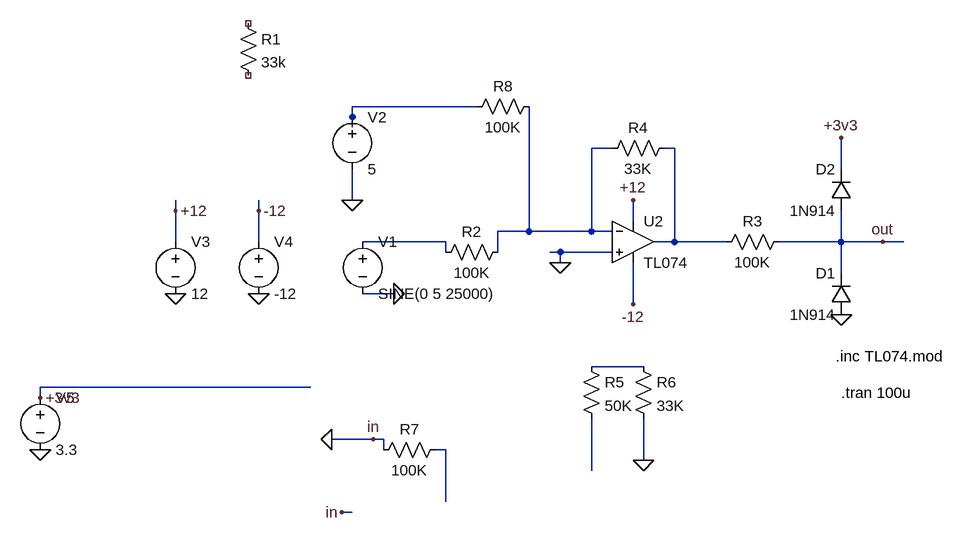
[diagram p0: schematic CVin.asc]
CVin.asc, the LTspice schematic file:
Version 4
SHEET 1 916 752
WIRE 96 64 -96 64
WIRE -96 80 -96 64
WIRE -96 96 -96 80
WIRE 304 128 272 128
WIRE 400 128 384 128
WIRE 656 160 656 112
WIRE -96 208 -96 160
WIRE -368 224 -368 208
WIRE -240 224 -240 208
WIRE 336 240 336 208
WIRE 176 256 176 64
WIRE 176 256 128 256
WIRE 272 256 272 128
WIRE 272 256 176 256
WIRE 304 256 272 256
WIRE -368 272 -368 224
WIRE -240 272 -240 224
WIRE 48 272 -80 272
WIRE 400 272 400 128
WIRE 400 272 368 272
WIRE 480 272 400 272
WIRE 656 272 656 224
WIRE 656 272 560 272
WIRE 720 272 656 272
WIRE 752 272 720 272
WIRE 48 288 48 272
WIRE 128 288 128 256
WIRE 224 288 208 288
WIRE 304 288 224 288
WIRE 224 304 224 288
WIRE 656 320 656 272
WIRE -32 352 -80 352
WIRE 336 368 336 304
WIRE 352 464 272 464
WIRE -160 496 -576 496
WIRE -576 512 -576 496
WIRE -64 576 -128 576
WIRE -48 576 -64 576
WIRE -48 592 -48 576
WIRE 48 592 32 592
WIRE 352 608 352 544
WIRE 272 624 272 544
WIRE 48 672 48 592
WIRE -96 688 -112 688
FLAG -32 352 0
FLAG 720 272 out
FLAG -96 208 0
FLAG -368 352 0
FLAG -240 352 0
FLAG -368 224 +12
FLAG -240 224 -12
FLAG 336 208 +12
FLAG 336 368 -12
FLAG -576 512 +3v3
FLAG -576 592 0
FLAG -112 688 in
FLAG 656 384 0
FLAG 656 112 +3v3
FLAG 352 608 0
FLAG -64 576 in
FLAG -128 576 0
FLAG 224 304 0
SYMBOL voltage -80 256 R0
SYMATTR InstName V1
SYMATTR Value SINE(0 5 25000)
SYMATTR Value2 AC 11
SYMBOL Opamps/opamp2 336 208 R0
SYMATTR InstName U2
SYMATTR Value TL074
SYMBOL res 576 256 R90
WINDOW 0 0 56 VBottom 2
WINDOW 3 32 56 VTop 2
SYMATTR InstName R3
SYMATTR Value 100K
SYMBOL res 400 112 R90
WINDOW 0 0 56 VBottom 2
WINDOW 3 32 56 VTop 2
SYMATTR InstName R4
SYMATTR Value 33K
SYMBOL res -272 -80 R0
SYMATTR InstName R1
SYMATTR Value 33k
SYMBOL res 144 272 R90
WINDOW 0 0 56 VBottom 2
WINDOW 3 32 56 VTop 2
SYMATTR InstName R2
SYMATTR Value 100K
SYMBOL voltage -96 64 R0
SYMATTR InstName V2
SYMATTR Value 5
SYMBOL voltage -368 256 R0
SYMATTR InstName V3
SYMATTR Value 12
SYMBOL voltage -240 256 R0
SYMATTR InstName V4
SYMATTR Value -12
SYMBOL voltage -576 496 R0
SYMATTR InstName V5
SYMATTR Value 3.3
SYMBOL diode 672 384 R180
WINDOW 0 24 64 Left 2
WINDOW 3 24 0 Left 2
SYMATTR InstName D1
SYMATTR Value 1N914
SYMBOL diode 672 224 R180
WINDOW 0 24 64 Left 2
WINDOW 3 24 0 Left 2
SYMATTR InstName D2
SYMATTR Value 1N914
SYMBOL res 256 448 R0
SYMATTR InstName R5
SYMATTR Value 50K
SYMBOL res 336 448 R0
SYMATTR InstName R6
SYMATTR Value 33K
SYMBOL res 48 576 R90
WINDOW 0 0 56 VBottom 2
WINDOW 3 32 56 VTop 2
SYMATTR InstName R7
SYMATTR Value 100K
SYMBOL res 192 48 R90
WINDOW 0 0 56 VBottom 2
WINDOW 3 32 56 VTop 2
SYMATTR InstName R8
SYMATTR Value 100K
TEXT 648 448 Left 2 !.inc TL074.mod
TEXT 656 504 Left 2 !.tran 100u

The netlist it stands for:
* CVin.asc
V1 N004 0 SINE(0 5 25000) AC 11
XU2 0 N002 +12 -12 N003 TL074  ; pins In+ In- V+ V- OUT
R3 out N003 100K
R4 N003 N002 33K
R1 NC_01 NC_02 33k
R2 N002 N004 100K
V2 N001 0 5
V3 +12 0 12
V4 -12 0 -12
V5 +3v3 0 3.3
D1 0 out 1N914
D2 out +3v3 1N914
R5 N005 N007 50K
R6 N005 0 33K
R7 N006 0 100K
R8 N002 N001 100K
.model D D
.lib standard.dio
.inc TL074.mod
.tran 100u
.backanno
.end